# Altium schematic sheet [5] - Motor_Driver.SchDoc
size 420 x 297 mm; DocumentNumber: 5; SheetNumber: 5; SheetTotal: 11
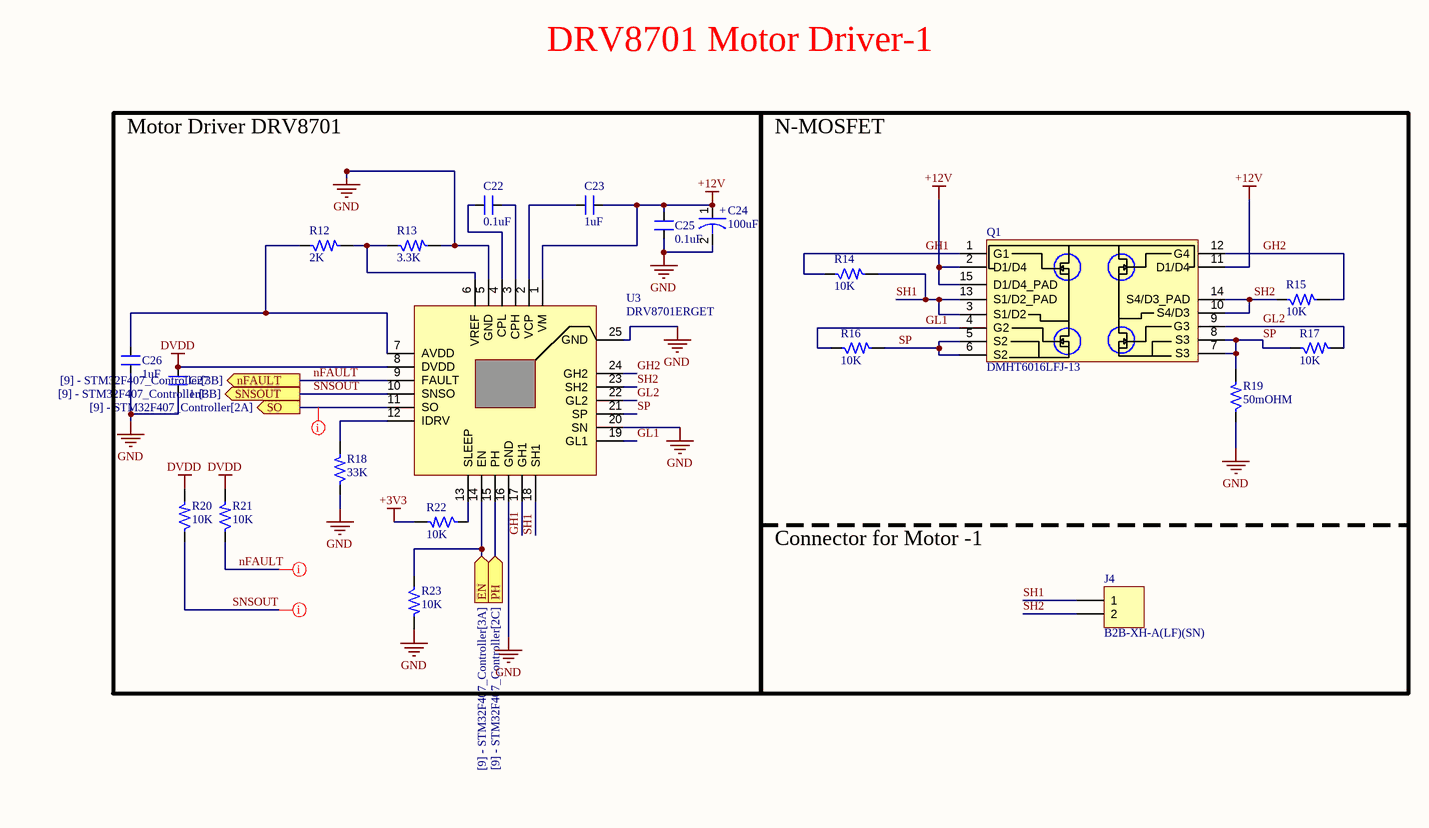
[diagram p0: [5] - Motor_Driver.SchDoc]

## Parts
C22  0.1uF  [CAP_0805]
C23  1uF  [CAP_0805]
C24  100uF  [ACAP_P236_D305_H303_RAD]
C25  0.1uF  [CAP_0805]
C26  1uF  [CAP_0805]
C27  1uF  [CAP_0805]
J4  B2B-XH-A(LF)(SN)  [CON2_100_B2B-XH-A_TH_ST]
Q1  DMHT6016LFJ-13  [DFN5045-12_33_212_27X15_SMD_1]
R12  2K  [RES_0805]
R13  3.3K  [RES_0805]
R14  10K  [RES_0805]
R15  10K  [RES_0805]
R16  10K  [RES_0805]
R17  10K  [RES_0805]
R18  33K  [RES_0805]
R19  50mOHM  [RES_2512]
R20  10K  [RES_0805]
R21  10K  [RES_0805]
R22  10K  [RES_0805]
R23  10K  [RES_0805]
U3  DRV8701ERGET  [VFQFN24_19.6_196_12X32_SMD_1]

## Blocks framed on the sheet
Motor Driver DRV8701: C22-C27 R12 R13 R18 R20-R23 U3

## Ports
EN (in, see [9] - STM32F407_Controller[3A]), nFAULT (out, see [9] - STM32F407_Controller[3B]), PH (in, see [9] - STM32F407_Controller[2C]), SNSOUT (out, see [9] - STM32F407_Controller[3B]), SO (out, see [9] - STM32F407_Controller[2A])

## Nets
+3V3: R22.2
+12V: C23.2 C24.1 C25.2 Q1.2(D1/D4) Q1.11(D1/D4) Q1.15(D1/D4_PAD) U3.1(VM)
DVDD: C27.1 R20.2 R21.2 U3.8(DVDD)
GND: C24.2 C25.1 C26.1 C27.2 R13.2 R18.1 R19.1 R23.2 U3.5(GND) U3.16(GND) U3.20(SN) U3.25(GND)
EN: R23.1 U3.14(EN) ; port EN
GH1: Q1.1(G1) R14.1 U3.17(GH1)
GH2: Q1.12(G4) R15.2 U3.24(GH2)
GL1: Q1.4(G2) R16.1 U3.19(GL1)
GL2: Q1.9(G3) R17.2 U3.22(GL2)
nFAULT: R21.1 U3.9(FAULT) ; port nFAULT
PH: U3.15(PH) ; port PH
SH1: J4.1 Q1.3(S1/D2) Q1.13(S1/D2_PAD) R14.2 U3.18(SH1)
SH2: J4.2 Q1.10(S4/D3) Q1.14(S4/D3_PAD) R15.1 U3.23(SH2)
SNSOUT: R20.1 U3.10(SNSO) ; port SNSOUT
SO: U3.11(SO) ; port SO
SP: Q1.5(S2) Q1.6(S2) Q1.7(S3) Q1.8(S3) R16.2 R17.1 R19.2 U3.21(SP)
NetC22_1: C22.1 U3.3(CPH)
NetC22_2: C22.2 U3.4(CPL)
NetC23_1: C23.1 U3.2(VCP)
NetC26_2: C26.2 R12.1 U3.7(AVDD)
NetR12_2: R12.2 R13.1 U3.6(VREF)
NetR18_2: R18.2 U3.12(IDRV)
NetR22_1: R22.1 U3.13(SLEEP)

## Layout directives
net class Critical_Nets: nFAULT, SNSOUT, SO

## Notes on the sheet
- DRV8701 Motor Driver-1
- N-MOSFET
- Connector for Motor -1
- THIS DOCUMENT AND THE DATA DISCLOSED HEREIN OR
- HEREWITH IS THE PROPERTY OF ALTIUM LIMITED AND MAY
- DWG NO:
- REVISION
- REV:
- DESCRIPTION
- DATE
- APPROVED
- BE FREELY DISTRIBUTED IN WHOLE. NO RIGHTS ARE
- RESERVED OR EXPRESS OR IMPLIED WARANTEE GIVEN.
- ENG:
- APPROVALS
- PROJECT
- DSN:
- CHK:
- REFERENCE DOCUMENTS
- PROJECT REVISION:
- TITLE
- DOCUMENT REVISION:
- DESIGN ITEM:
- BOM:
- FAB DWG:
- PCB DWG:
- ASSY DWG:
- SCALE:
- A3
- SIZE
- CAGE CODE
- FILE NAME
- DWG NO.
- SHEET
- OF
- REV
- (in symbol CAP-P_100uF-25V-20%-RAD) +

## Library data of the parts
C22 C25 = CAP_0.1uF-50V-10%-0805: 0.1µF ±10% 50V Ceramic Capacitor X7R 0805 (2012 Metric); Manufacturer: Samsung; Manufacturer Part Number: CL21B104KBCNNNC; Alternate Part Number-1: NA; Case/Package: 0805; Supplier-1: SIRICOM; Supplier Part Number-1: 0805B104K500CT
C23 C26 C27 = CAP_1uF-50V-5%-0805: 1µF ±5% 50V Ceramic Capacitor X7R 0805 (2012 Metric); Manufacturer: Samsung; Manufacturer Part Number: CC0805JKX7R9BB105; Alternate Part Number-1: 0805F105M500NT; Case/Package: 0805; Supplier-1: SIRICOM; Supplier Part Number-1: CL21B105KBFNNNE
C24 = CAP-P_100uF-25V-20%-RAD: 100µF 25V Aluminum Electrolytic Capacitors Radial, Can - SMD 1000 Hrs @ 105°C; Manufacturer: Nichicon; Manufacturer Part Number: UWT1E101MCL1GS; Alternate Part Number-1: NA; Case/Package: Radial-SMD; Supplier-1: SP ROAD; Supplier Part Number-1: UWT1E101MCL1GS
J4 = CON-PLG_2X1-100-ST-TH: 2 Pins, 1 Row 2.54mm Pitch, Straight Connector, male; Manufacturer: JST; Mating Part Number: XHP-2; Crimp Part Number: ASXHSXH22K51; Alternate Part Number-1: NA; Manufacturer Part Number: B2B-XH-A(LF)(SN); Case/Package: TH-CON; Supplier-1: SP ROAD; Supplier Part Number-1: B2B-XH-A(LF)(SN)
Q1 = MOSFET-N_60V-14.8A-V-DFN5045-12: Mosfet Array 4 N-Channel 14.8A (Ta) Surface Mount V-DFN5045-12; Manufacturer: ON Semiconductor; Alternate Part Number-1: DMHT3006LFJ-13; Manufacturer Part Number: DMHT6016LFJ-13; Case/Package: DFN5045-12; Supplier-1: LCSC; Supplier Part Number-1: C460986
R12 = RES_2K-0.125W-1%-0805: 2 kOhms ±1% 0.125W, 1/8W Chip Resistor 0805 (2012 Metric) Moisture Resistant Thick Film; Manufacturer: TE Connectivity; Manufacturer Part Number: RC0805FR-072KL; Alternate Part Number-1: NA; Case/Package: 0805; Supplier-1: SIRICOM; Supplier Part Number-1: WR08X2001FTL
R13 = RES_3.3K-0.125W-1%-0805: 3.3 kOhms ±1% 0.125W, 1/8W Chip Resistor 0805 (2012 Metric) Thick Film; Manufacturer: Panasonic; Manufacturer Part Number: 1623214-1; Alternate Part Number-1: 0805W8F3301T5E; Case/Package: 0805; Supplier-1: SIRICOM; Supplier Part Number-1: WR08X3301FTL
R14-R17 R20-R23 = RES_10K-0.125W-1%-0805: 10 kOhms ±1% 0.125W, 1/8W Chip Resistor 0805 (2012 Metric) Automotive AEC-Q200 Thick Film; Manufacturer: CTS; Manufacturer Part Number: WR08X1002FTL; Case/Package: 0805; Supplier-1: SIRICOM; Supplier Part Number-1: WR08X1002FTL; Alternate Part Number-1: WR08X1002FTL
R18 = RES_33K-0.125W-1%-0805: Thick Film Resistors - SMD 33KOhms 1/8W 150V33 kOhms ±1% 0.125W, 1/8W Chip Resistor 0805 (2012 Metric) Thick Film; Manufacturer: Vishay BCcomponents; Manufacturer Part Number: CRG0805F33K; Alternate Part Number-1: NA; Case/Package: 0805; Supplier-1: SIRICOM; Supplier Part Number-1: WR08X3302FTL
R19 = RES_50mOhm-2W-1%-2512: 50 mOhms ±1% 2W Chip Resistor 2512 (6432 Metric) Automotive AEC-Q200, Current Sense, Moisture Resistant Metal Element; Manufacturer: Yageo; Manufacturer Part Number: PA2512FKF7W0R05E; Alternate Part Number-1: PMR100HZPFU5L00; Case/Package: 2512; Supplier-1: SIRICOM; Supplier Part Number-1: LR2512-22R060F1
U3 = IC_DRV8701ERGET: Motor Driver Power MOSFET Parallel 24-VQFN (4x4); Manufacturer: Texas Instruments; Alternate Part Number-1: NA; Manufacturer Part Number: DRV8701ERGET; Case/Package: VFQFN24; Supplier-1: ARROW; Supplier Part Number-1: DRV8701ERGET